# Altium project PCB_Project.PrjPCB
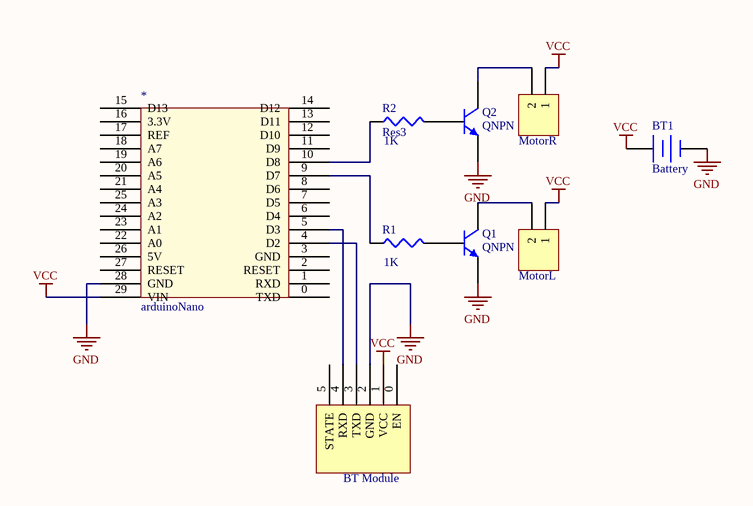
[diagram p0: main.SchDoc]
1 sheet, 9 parts. Net scope: global (net labels, ports and power ports of the same name join across sheets).
Board file: PCB.PcbDoc

## Sheet main.SchDoc
size A4

### Parts
*  arduinoNano  [arduinoNano]
BT1  Battery  [BAT-2]
MotorL  Header 2  [HDR1X2]  (value not drawn)
MotorR  Header 2  [HDR1X2]  (value not drawn)
Q1  QNPN  [SOT-23_M]
Q2  QNPN  [SOT-23_M]
R1  value 1K  [J1-0603]  (hidden comment: Res3)
R2  Res3  value 1K  [J1-0603]
  BT Module  [HC-05]

### Nets
GND: *.28(GND) BT1.2(-) Q1.3(E) Q2.3(E) .2(GND)
VCC: *.29(VIN) BT1.1(+) MotorL.1 MotorR.1 .1(VCC)
Net*_4: *.4(D2) .3(TXD)
Net*_5: *.5(D3) .4(RXD)
Net*_9: *.9(D7) R1.1
Net*_10: *.10(D8) R2.1
NetMotorL_2: MotorL.2 Q1.1(C)
NetMotorR_2: MotorR.2 Q2.1(C)
NetQ1_2: Q1.2(B) R1.2
NetQ2_2: Q2.2(B) R2.2

Not connected (* = marked no-connect by the designer): * 0(TXD) 1(RXD) 2(RESET) 3(GND) 6(D4) 7(D5) 8(D6) 11(D9) 12(D10) 13(D11) 14(D12) 15(D13) 16(3.3V) 17(REF) 18(A7) 19(A6) 20(A5) 21(A4) 22(A0) 23(A1) 24(A2) 25(A3) 26(5V) 27(RESET);  0(EN) 5(STATE)

### Library data of the parts
BT1 = Battery: Multicell Battery; Published: 24-Mar-1999; LatestRevisionDate: 17-Jul-2002; LatestRevisionNote: Re-released for DXP Platform.; PackageReference: BAT-2; Publisher: Altium Limited; PackageDescription: Battery; 2 Leads
MotorL MotorR = Header 2: Header, 2-Pin; LatestRevisionDate: 17-Jul-2002; LatestRevisionNote: Re-released for DXP Platform.; Publisher: Altium Limited
Q1 Q2 = QNPN: NPN Bipolar Transistor; pin to pad: 1>3 2>1 3>2; Published: 8-Jun-2000; LatestRevisionDate: 29-May-2009; LatestRevisionNote: IPC-7351 Footprint Added.; PackageVersion: Aug-1999; PackageReference: SOT-23B; Publisher: Altium Limited; PackageDescription: 3-Pin SOT-23 Package 0.95 mm Pitch, 2.4 mm Lead Span
R1 R2 = Res3: Resistor; Published: 8-Jun-2000; LatestRevisionDate: 29-May-2009; LatestRevisionNote: IPC-7351 Footprint Added.; PackageReference: J1-0603; Publisher: Altium Limited; PackageDescription: Chip Resistor
 = HC-05